# EasyEDA schematic BroadNodeVerticle.json
TITLE: BroadNodeBase; REV: 1.0; Date: 2020-12-08; Sheet: 1/1; Drawn By: 36062A; Company: theBroadCorp.
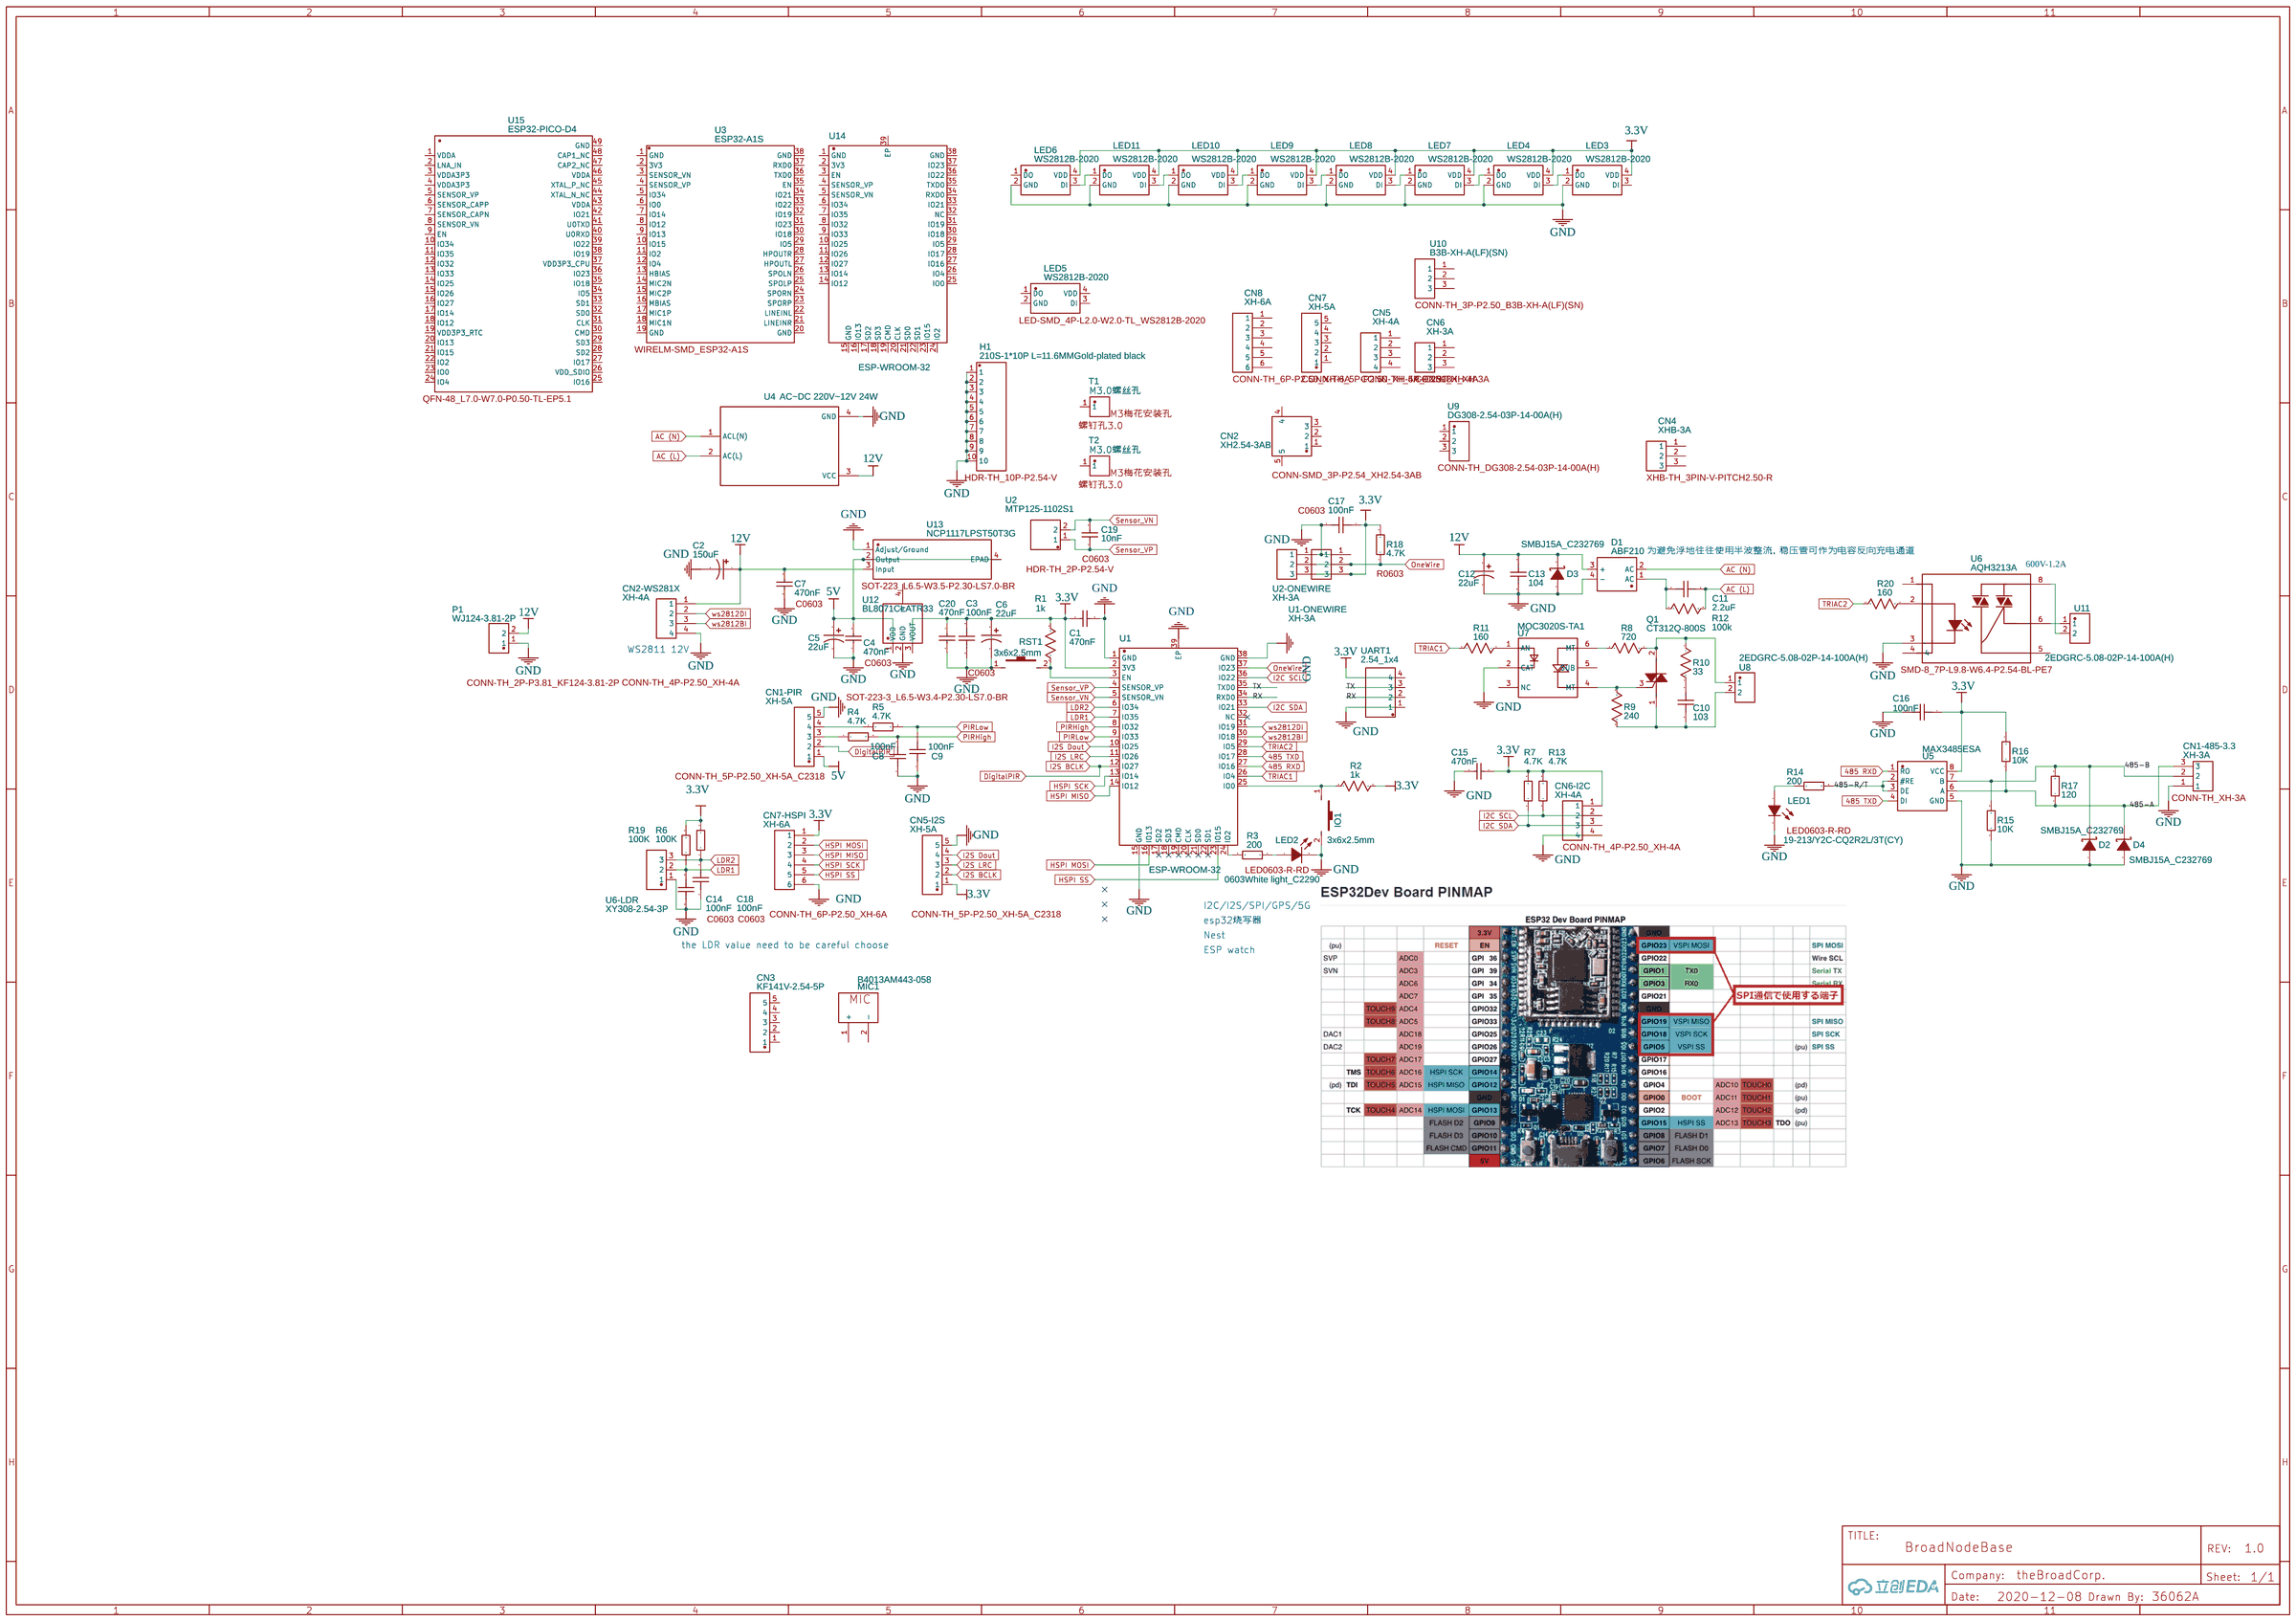
[diagram p0: schematic sheet]

## Parts
C1  470nF  [C0603]
C2  150uF  [CAP-SMD_BD8.0-L8.3-W8.3-RD]
C3  100nF  [C0603]
C4  470nF  [C0603]
C5  22uF  [CAP-SMD_BD6.3-L6.6-W6.6-FD]
C6  22uF  [CAP-SMD_BD6.3-L6.6-W6.6-FD]
C7  470nF  [C0603]
C8  100nF  [C0603]
C9  100nF  [C0603]
C10  103  [0603]
C11  2.2uF  [0603]
C12  22uF  [CAP-SMD_BD6.3-L6.6-W6.6-FD]
C13  104  [0603]
C14  100nF  [C0603]
C15  470nF  [C0603]
C16  100nF  [CAP_0603]
C17  100nF  [C0603]
C18  100nF  [C0603]
C19  10nF  [C0603]
C20  470nF  [C0603]
CN1-485-3  XH-3A  [CONN-TH_XH-3A]  (section 3)
CN1-PIR  XH-5A  [CONN-TH_5P-P2.50_XH-5A_C2318]
CN2  XH2.54-3AB  [CONN-SMD_3P-P2.54_XH2.54-3AB]
CN2-WS281X  XH-4A  [CONN-TH_4P-P2.50_XH-4A]
CN3  KF141V-2.54-5P  [CONN-TH_5P-P2.54_KF141V-2.54-5P]
CN4  XHB-3A  [XHB-TH_3PIN-V-PITCH2.50-R]
CN5  XH-4A  [CONN-TH_4P-P2.50_XH-4A]
CN5-I2S  XH-5A  [CONN-TH_5P-P2.50_XH-5A_C2318]
CN6  XH-3A  [CONN-TH_XH-3A]
CN6-I2C  XH-4A  [CONN-TH_4P-P2.50_XH-4A]
CN7  XH-5A  [CONN-TH_5P-P2.50_XH-5A_C2318]
CN7-HSPI  XH-6A  [CONN-TH_6P-P2.50_XH-6A]
CN8  XH-6A  [CONN-TH_6P-P2.50_XH-6A]
D1  ABF210  [ABS_L5.3-W4.6-P4.00-LS6.8-BL]
D2  SMBJ15A_C232769  [SMB(DO-214AA)]
D3  SMBJ15A_C232769  [SMB(DO-214AA)]
D4  SMBJ15A_C232769  [SMB(DO-214AA)]
H1  210S-1*10P L=11.6MMGold-plated black  [HDR-TH_10P-P2.54-V]
IO1  3x6x2.5mm  [KEY-3.0*6.0]
LED1  19-213/Y2C-CQ2R2L/3T(CY)  [LED0603-R-RD]
LED2  0603White light_C2290  [LED0603-R-RD]
LED3  WS2812B-2020  [LED-SMD_4P-L2.0-W2.0-TL_WS2812B-2020]
LED4  WS2812B-2020  [LED-SMD_4P-L2.0-W2.0-TL_WS2812B-2020]
LED5  WS2812B-2020  [LED-SMD_4P-L2.0-W2.0-TL_WS2812B-2020]
LED6  WS2812B-2020  [LED-SMD_4P-L2.0-W2.0-TL_WS2812B-2020]
LED7  WS2812B-2020  [LED-SMD_4P-L2.0-W2.0-TL_WS2812B-2020]
LED8  WS2812B-2020  [LED-SMD_4P-L2.0-W2.0-TL_WS2812B-2020]
LED9  WS2812B-2020  [LED-SMD_4P-L2.0-W2.0-TL_WS2812B-2020]
LED10  WS2812B-2020  [LED-SMD_4P-L2.0-W2.0-TL_WS2812B-2020]
LED11  WS2812B-2020  [LED-SMD_4P-L2.0-W2.0-TL_WS2812B-2020]
MIC1  B4013AM443-058  [MIC-SMD_BD4.0_B4013AM423-093]
P1  WJ124-3.81-2P  [CONN-TH_2P-P3.81_KF124-3.81-2P]
Q1  CT312Q-800S  [TO-263-2_L10.1-W9.1-P5.08-LS15.2-BR]
R1  1k  [0603]
R2  1k  [0603]
R3  200  [RES_0603]
R4  4.7K  [R0603]
R5  4.7K  [R0603]
R6  100K  [R0603]
R7  4.7K  [R0603]
R8  720  [0603]
R9  240  [0603]
R10  33  [0603]
R11  160  [0603]
R12  100k  [0603]
R13  4.7K  [R0603]
R14  200  [RES_0603]
R15  10K  [RES_0603]
R16  10K  [RES_0603]
R17  120  [RES_0603]
R18  4.7K  [R0603]
R19  100K  [R0603]
R20  160  [0603]
RST1  3x6x2.5mm  [KEY-3.0*6.0]
T1  M3.0螺丝孔  [螺钉孔3.0]
T2  M3.0螺丝孔  [螺钉孔3.0]
U1  ESP-WROOM-32  [ESP-WROOM-32]
U1-ONEWIRE  XH-3A  [CONN-TH_XH-3A]
U2  MTP125-1102S1  [HDR-TH_2P-P2.54-V]
U2-ONEWIRE  XH-3A  [CONN-TH_XH-3A]
U3  ESP32-A1S  [WIRELM-SMD_ESP32-A1S]
U4  AC~DC 220V~12V 24W  [AC&#126;DC 220V&#126;12V 24W TB563350789812]
U5  MAX3485ESA  [SOP-8_L5.0-W4.0-P1.27-LS6.0-BL]
U6  AQH3213A  [SMD-8_7P-L9.8-W6.4-P2.54-BL-PE7]
U6-LDR  XY308-2.54-3P  [CONN-TH_XY308-2.54-3P]
U7  MOC3020S-TA1  [SMD-6_L7.3-W6.5-P2.54-LS10.16-BL]
U8  2EDGRC-5.08-02P-14-100A(H)  [CONN-TH_2EDGRC-5.08-02P-14-100A(H)]
U9  DG308-2.54-03P-14-00A(H)  [CONN-TH_DG308-2.54-03P-14-00A(H)]
U10  B3B-XH-A(LF)(SN)  [CONN-TH_3P-P2.50_B3B-XH-A(LF)(SN)]
U11  2EDGRC-5.08-02P-14-100A(H)  [CONN-TH_2EDGRC-5.08-02P-14-100A(H)]
U12  BL8071CLATR33  [SOT-223-3_L6.5-W3.4-P2.30-LS7.0-BR]
U13  NCP1117LPST50T3G  [SOT-223_L6.5-W3.5-P2.30-LS7.0-BR]
U14  ESP-WROOM-32  [ESP-WROOM-32]
U15  ESP32-PICO-D4  [QFN-48_L7.0-W7.0-P0.50-TL-EP5.1]
UART1  2.54_1x4  [DIP-1X4P-2.54MM-M]

## Library data of the parts
C1 C15 C20 = CL10B474KA8NNNC: Supplier: LCSC; Manufacturer: SAMSUNG; Supplier Part: C1623; SMT Type: Basic; JLCPCB SMD: Yes; Package Display: No
C2 = OVZ151M1C0807-TRO: Supplier: LCSC; Supplier Part: C250092; Manufacturer: Lelon; Contributor: LCSC; SMT Type: Extend; JLCPCB SMD: Yes
C3 C14 C17 C18 = CC0603KRX7R9BB104: Supplier: LCSC; Manufacturer: YAGEO; Supplier Part: C14663; SMT Type: Basic; JLCPCB SMD: Yes; Package Display: Yes
C4 C7 = CL10B474KA8NNNC: Supplier: LCSC; Manufacturer: SAMSUNG; Supplier Part: C1623; SMT Type: Basic; JLCPCB SMD: Yes; Package Display: Yes
C5 C6 C12 = OCV220M1VTR-0606: Supplier: LCSC; Supplier Part: C473426; Manufacturer: Lelon; Contributor: LCSC
C8 C9 = CC0603KRX7R9BB104: Supplier: LCSC; Manufacturer: YAGEO; Supplier Part: C14663; SMT Type: Basic; JLCPCB SMD: Yes; Package Display: No
C10 = Cap_0603_US: Manufacturer Part: 0603B103K500NT; Supplier: LCSC; Manufacturer: FH; Supplier Part: C57112
C11 = Cap_0603_US
C13 = Cap_0603_US: Manufacturer Part: CL10B224KA8NNNC; Supplier: LCSC; Manufacturer: SAMSUNG; Supplier Part: C21120
C16 = CC0603KRX7R9BB104: Supplier: LCSC; Manufacturer: YAGEO; LCSC Assembly: Yes; Supplier Part: C14663; SMT Type: Basic
C19 = 0603B103K500NT: Supplier: LCSC; Manufacturer: FH; Supplier Part: C57112; SMT Type: Basic; JLCPCB SMD: Yes; Package Display: Yes
CN1-485-3 CN6 = XH-3A: Supplier: LCSC; Manufacturer: BOOMELE; image: //image.lceda.cn/szlcsc/C2316.jpg; Supplier Part: C2316; Package Display: Yes
CN1-PIR CN5-I2S CN7 = XH-5A: Supplier: LCSC; Manufacturer: BOOMELE; image: //image.lceda.cn/szlcsc/C2318.jpg; Supplier Part: C2318; Package Display: Yes
CN2 = XH2.54-3AB: Supplier: LCSC; Supplier Part: C146126; Manufacturer: Boom Precision Elec; Contributor: LCSC; Package Display: Yes
CN2-WS281X CN5 CN6-I2C = XH-4A: Supplier: LCSC; Manufacturer: BOOMELE; image: //image.lceda.cn/szlcsc/C37815.jpg; Supplier Part: C37815; Package Display: Yes
CN3 = KF141V-2.54-5P: Supplier: LCSC; Supplier Part: C475117; Manufacturer: Cixi Kefa Elec; Contributor: LCSC
CN4 = XHB-3A: Supplier: LCSC; Manufacturer: BOOMELE; image: //image.lceda.cn/szlcsc/C68817.jpg; Supplier Part: C68817; Package Display: Yes
CN7-HSPI CN8 = XH-6A: Supplier: LCSC; Manufacturer: BOOMELE; image: //image.lceda.cn/szlcsc/C5663.jpg; Supplier Part: C5663; Package Display: Yes
D1 = ABF210: Supplier: LCSC; Manufacturer: Jingdao; Contributor: LCSC; Supplier Part: C169534; SMT Type: Extend; JLCPCB SMD: Yes
D2-D4 = -: Supplier: LCSC; Supplier Part: C232769; Manufacturer: ON Semicon; Manufacturer Part: SMBJ15A; Contributor: LCSC
H1 = 210S-1*10P L=11.6MMGold-plated black: Supplier: LCSC; Manufacturer: Ckmtw; Contributor: LCSC; Supplier Part: C124372; Package Display: Yes
IO1 RST1 = -: Supplier Part: C5382; Supplier: LCSC; Manufacturer: ReliaPro
LED1 = 19-213/Y2C-CQ2R2L/3T(CY): Supplier: LCSC; Manufacturer: EVERLIGHT; image: //image.lceda.cn/szlcsc/C72038.jpg; Supplier Part: C72038; SMT Type: Basic; JLCPCB SMD: Yes; Package Display: Yes
LED2 = 0603White light_C2290: Supplier: LCSC; Manufacturer: KENTO; Manufacturer Part: 0603White light; image: //image.lceda.cn/szlcsc/C2290.jpg; Supplier Part: C2290; SMT Type: Basic; JLCPCB SMD: Yes; Package Display: Yes
LED3 LED4 LED6-LED11 = WS2812B-2020: Supplier: LCSC; Supplier Part: C965555; Manufacturer: Worldsemi; Contributor: LCSC; Package Display: No
LED5 = WS2812B-2020: Supplier: LCSC; Supplier Part: C965555; Manufacturer: Worldsemi; Contributor: LCSC; Package Display: Yes
MIC1 = B4013AM443-058: Supplier: LCSC; Supplier Part: C233795; Manufacturer: Goertek; Contributor: LCSC
P1 = WJ124-3.81-2P: Supplier: LCSC; Manufacturer: ReliaPro; image: //image.lceda.cn/szlcsc/C69811.jpg; Supplier Part: C69811; Package Display: Yes
Q1 = CT312Q-800S: Supplier: LCSC; Supplier Part: C527795; Manufacturer: CJ; Contributor: LCSC; SMT Type: Extend; JLCPCB SMD: Yes
R1 R2 R8 = Res_0603(1/10W)_US: Manufacturer Part: 0603WAF7500T5E; Supplier: LCSC; Manufacturer: UniOhm; Supplier Part: C23241
R3 R14 = MCR03EZPJ201: Supplier: LCSC; Supplier Part: C253407; Manufacturer: ROHM Semicon; Contributor: LCSC
R4 R5 R7 R13 = 0603WAF4701T5E: Supplier: LCSC; Manufacturer: UniOhm; Supplier Part: C23162; SMT Type: Basic; JLCPCB SMD: Yes
R6 R19 = 0603WAF1003T5E: Supplier: LCSC; Manufacturer: UniOhm; Supplier Part: C25803; SMT Type: Basic; JLCPCB SMD: Yes
R9 = Res_0603(1/10W)_US: Manufacturer Part: 0603WAF2200T5E; Supplier: LCSC; Manufacturer: UniOhm; Supplier Part: C22962
R10 = Res_0603(1/10W)_US: Manufacturer Part: 0603WAF330JT5E; Supplier: LCSC; Manufacturer: UniOhm; Supplier Part: C23140
R11 R20 = Res_0603(1/10W)_US: Manufacturer Part: 0603WAF1600T5E; Supplier: LCSC; Manufacturer: UniOhm; Supplier Part: C22814
R12 = Res_0603(1/10W)_US: Manufacturer Part: 0603WAF2003T5E; Supplier: LCSC; Manufacturer: UniOhm; Supplier Part: C25811
R15 R16 = RMCF0603JT10K0: Supplier: LCSC; Supplier Part: C238881; Manufacturer: Stackpole Elec; Contributor: LCSC
R17 = MCR03EZPFX1200: Supplier: LCSC; Supplier Part: C253379; Manufacturer: ROHM Semicon; Contributor: LCSC
R18 = 0603WAF4701T5E: Supplier: LCSC; Manufacturer: UniOhm; Supplier Part: C23162; SMT Type: Basic; JLCPCB SMD: Yes; Package Display: Yes
T1 T2 = M3.0螺丝孔: Contributor: wowlkh; Package Display: Yes
U1 U14 = -: Supplier: LCSC; Manufacturer: ESPRESSIF; Supplier Part: C95209
U1-ONEWIRE U2-ONEWIRE = XH-3A: Supplier: LCSC; Manufacturer: BOOMELE; image: //image.lceda.cn/szlcsc/C2316.jpg; Supplier Part: C2316; Package Display: No
U2 = MTP125-1102S1: Supplier: LCSC; Supplier Part: C358684; Manufacturer: MINTRON; Contributor: LCSC; Package Display: Yes
U3 = ESP32-A1S: Supplier: LCSC; Supplier Part: C277945; Manufacturer: Ai-Thinker; Contributor: LCSC; Package Display: Yes
U4 = AC&#126;DC 220V&#126;12V 24W: Manufacturer Part: New SchematicLib; Contributor: Kisro
U5 = MAX3485ESA: Supplier: LCSC; Supplier Part: C668204; Manufacturer: UMW(Youtai Semiconductor Co., Ltd.); Contributor: LCSC
U6 = AQH3213A: Supplier: LCSC; Manufacturer: PANASONIC; Contributor: LCSC; Supplier Part: C91557; Package Display: Yes
U6-LDR = XY308-2.54-3P: Supplier: LCSC; Supplier Part: C557686; Manufacturer: --; Contributor: LCSC
U7 = MOC3020S-TA1: Supplier: LCSC; Manufacturer: LITEON; Contributor: LCSC; Supplier Part: C115464; SMT Type: Extend; JLCPCB SMD: Yes
U8 U11 = 2EDGRC-5.08-02P-14-100A(H): Supplier: LCSC; Supplier Part: C669314; Manufacturer: DEGSON; Contributor: LCSC
U9 = DG308-2.54-03P-14-00A(H): Supplier: LCSC; Supplier Part: C691850; Manufacturer: DEGSON; Contributor: LCSC; Package Display: Yes
U10 = B3B-XH-A(LF)(SN): Supplier: LCSC; Supplier Part: C144394; Manufacturer: JST Sales America; Contributor: LCSC; Package Display: Yes
U12 = BL8071CLATR33: Supplier: LCSC; Supplier Part: C401677; Manufacturer: Shanghai Belling; Contributor: LCSC; Package Display: Yes
U13 = NCP1117LPST50T3G: Supplier: LCSC; Supplier Part: C185806; Manufacturer: ON Semicon; Contributor: LCSC; SMT Type: Extend; JLCPCB SMD: Yes; Package Display: Yes
U15 = ESP32-PICO-D4: Supplier: LCSC; Supplier Part: C193707; Manufacturer: Espressif Systems; Contributor: LCSC; SMT Type: Extend; JLCPCB SMD: Yes; Package Display: Yes
UART1 = -: Supplier: LCSC; Manufacturer: Ckmtw; Manufacturer Part: 210S-1*4P L=11.6MMGold-plated black; Contributor: LCSC; Supplier Part: C124378

## Nets
3.3V: C1.2 C3.2 C6.1 C15.1 C16.1 C17.1 C20.1 CN5-I2S.1 CN6-I2C.1 CN7-HSPI.1 LED3.4(VDD) LED4.4(VDD) LED6.4(VDD) LED7.4(VDD) LED8.4(VDD) LED9.4(VDD) LED10.4(VDD) LED11.4(VDD) R1.2 R2.2 R6.2 R7.2 R13.2 R16.2 R18.2 R19.2 U1.2(3V3) U1-ONEWIRE.3 U2-ONEWIRE.3 U5.8(VCC) U12.3(VOUT) UART1.4
5V: C4.2 C5.1 CN1-PIR.1 U12.1(VDD) U13.2(Output) U13.4(EPAD)
12V: C2.1 C7.2 C12.1 C13.1 CN2-WS281X.1 D1.3(+) D3.2(K) P1.2 U4.3(VCC) U13.3(Input)
GND: C1.1 C2.2 C3.1 C4.1 C5.2 C6.2 C7.1 C8.1 C9.1 C12.2 C13.2 C14.1 C15.2 C16.2 C17.2 C18.1 C20.2 CN1-485-3.1 CN1-PIR.5 CN2-WS281X.4 CN5-I2S.5 CN6-I2C.4 CN7-HSPI.6 D1.4(-) D2.1(A) D3.1(A) D4.1(A) H1.1 H1.2 H1.3 H1.4 H1.5 H1.6 H1.7 H1.8 H1.9 H1.10 IO1.2 LED1.2(C) LED2.2(K) LED3.2(GND) LED4.2(GND) LED6.2(GND) LED7.2(GND) LED8.2(GND) LED9.2(GND) LED10.2(GND) LED11.2(GND) P1.1 R15.1 RST1.1 U1.1(GND) U1.15(GND) U1.38(GND) U1.39(EP) U1-ONEWIRE.1 U2-ONEWIRE.1 U4.4(GND) U5.5(GND) U6.3 U6-LDR.1 U7.2(CAT) U12.2(GND) U13.1(Adjust/Ground) UART1.1
485 RXD: U1.27(IO16) U5.1(RO)
485 TXD: U1.28(IO17) U5.4(DI)
485-A: CN1-485-3.3 D4.2(K) R16.1 R17.1 U5.6(A)
485-B: CN1-485-3.2 D2.2(K) R15.2 R17.2 U5.7(B)
485-R/T: R14.2 U5.2(#RE) U5.3(DE)
AC (L): C11.2 R12.2 U4.2(AC(L))
AC (N): D1.2(AC) U4.1(ACL(N))
DigitalPIR: CN1-PIR.2 CN5-I2S.2 U1.12(IO27)
HSPI MISO: CN7-HSPI.3 U1.14(IO12)
HSPI MOSI: CN7-HSPI.2 U1.16(IO13)
HSPI SCK: CN7-HSPI.4 U1.13(IO14)
HSPI SS: CN7-HSPI.5 U1.23(IO15)
I2C SCL: CN6-I2C.2 R13.1 U1.36(IO22)
I2C SDA: CN6-I2C.3 R7.1 U1.33(IO21)
I2S Dout: CN5-I2S.4 U1.10(IO25)
I2S LRC: CN5-I2S.3 U1.11(IO26)
LDR1: C14.2 R19.1 U1.7(IO35) U6-LDR.2
LDR2: C18.2 R6.1 U1.6(IO34) U6-LDR.3
OneWire: R18.1 U1.37(IO23) U1-ONEWIRE.2 U2-ONEWIRE.2
PIRHigh: C8.2 R4.2 U1.8(IO32)
PIRLow: C9.2 R5.2 U1.9(IO33)
RX: U1.34(RXD0) UART1.2
Sensor_VN: C19.2 U1.5(SENSOR_VN) U2.2
Sensor_VP: C19.1 U1.4(SENSOR_VP) U2.1
TRIAC1: R11.2 U1.26(IO4)
TRIAC2: R20.2 U1.29(IO5)
TX: U1.35(TXD0) UART1.3
ws2812BI: CN2-WS281X.3 U1.30(IO18)
ws2812DI: CN2-WS281X.2 U1.31(IO19)
Net-(C10-1): C10.1 R10.2
Net-(C10-2): C10.2 Q1.1(T1) R9.1 U8.2
Net-(C11-1): C11.1 D1.1(AC) R12.1
Net-(CN1-PIR-3): CN1-PIR.3 R4.1
Net-(CN1-PIR-4): CN1-PIR.4 R5.1
Net-(IO1-1): IO1.1 R2.1 U1.25(IO0)
Net-(LED1-1): LED1.1(A) R14.1
Net-(LED2-1): LED2.1(A) R3.1
Net-(LED3-1): LED3.1(DO) LED4.3(DI)
Net-(LED4-1): LED4.1(DO) LED7.3(DI)
Net-(LED6-3): LED6.3(DI) LED11.1(DO)
Net-(LED7-1): LED7.1(DO) LED8.3(DI)
Net-(LED8-1): LED8.1(DO) LED9.3(DI)
Net-(LED9-1): LED9.1(DO) LED10.3(DI)
Net-(LED10-1): LED10.1(DO) LED11.3(DI)
Net-(Q1-2): Q1.2(T2) R8.1 R10.1 U8.1
Net-(Q1-3): Q1.3(G) R9.2 U7.4(MT)
Net-(R1-1): R1.1 RST1.2 U1.3(EN)
Net-(R3-2): R3.2 U1.24(IO2)
Net-(R8-2): R8.2 U7.6(MT)
Net-(R11-1): R11.1 U7.1(AN)
Net-(R20-1): R20.1 U6.2
Net-(U6-6): U6.6 U11.1
Net-(U6-8): U6.8 U11.2

Not connected (* = marked no-connect by the designer): CN2 1 2 3 4 5; CN3 1 2 3 4 5; CN4 1 2 3; CN5 1 2 3 4; CN6 1 2 3; CN7 1 2 3 4 5; CN8 1 2 3 4 5 6; LED3 3(DI); LED5 1(DO) 2(GND) 3(DI) 4(VDD); LED6 1(DO); MIC1 1(+) 2(-); T1 1; T2 1; U1 17(SD2)* 18(SD3)* 19(CMD)* 20(CLK)* 21(SD0)* 22(SD1)* 32(NC)*; U3 1(GND) 2(3V3) 3(SENSOR_VN) 4(SENSOR_VP) 5(IO34) 6(IO0) 7(IO14) 8(IO12) 9(IO13) 10(IO15) 11(IO2) 12(IO4) 13(HBIAS) 14(MIC2N) 15(MIC2P) 16(MBIAS) 17(MIC1P) 18(MIC1N) 19(GND) 20(GND) 21(LINEINR) 22(LINEINL) 23(SPORP) 24(SPORN) 25(SPOLP) 26(SPOLN) 27(HPOUTL) 28(HPOUTR) 29(IO5) 30(IO18) 31(IO23) 32(IO19) 33(IO22) 34(IO21) 35(EN) 36(TXD0) 37(RXD0) 38(GND); U6 1 4 5; U7 3(NC) 5(SUB); U9 1 2 3; U10 1 2 3; U12 4; U14 1(GND) 2(3V3) 3(EN) 4(SENSOR_VP) 5(SENSOR_VN) 6(IO34) 7(IO35) 8(IO32) 9(IO33) 10(IO25) 11(IO26) 12(IO27) 13(IO14) 14(IO12) 15(GND) 16(IO13) 17(SD2) 18(SD3) 19(CMD) 20(CLK) 21(SD0) 22(SD1) 23(IO15) 24(IO2) 25(IO0) 26(IO4) 27(IO16) 28(IO17) 29(IO5) 30(IO18) 31(IO19) 32(NC) 33(IO21) 34(RXD0) 35(TXD0) 36(IO22) 37(IO23) 38(GND) 39(EP); U15 1(VDDA) 2(LNA_IN) 3(VDDA3P3) 4(VDDA3P3) 5(SENSOR_VP) 6(SENSOR_CAPP) 7(SENSOR_CAPN) 8(SENSOR_VN) 9(EN) 10(IO34) 11(IO35) 12(IO32) 13(IO33) 14(IO25) 15(IO26) 16(IO27) 17(IO14) 18(IO12) 19(VDD3P3_RTC) 20(IO13) 21(IO15) 22(IO2) 23(IO0) 24(IO4) 25(IO16) 26(VDD_SDIO) 27(IO17) 28(SD2) 29(SD3) 30(CMD) 31(CLK) 32(SD0) 33(SD1) 34(IO5) 35(IO18) 36(IO23) 37(VDD3P3_CPU) 38(IO19) 39(IO22) 40(U0RXD) 41(U0TXD) 42(IO21) 43(VDDA) 44(XTAL_N_NC) 45(XTAL_P_NC) 46(VDDA) 47(CAP2_NC) 48(CAP1_NC) 49(GND)

## Notes on the sheet
- 为避免浮地往往使用半波整流，稳压管可作为电容反向充电通道
- 600V-1.2A
- WS2811 12V
- I2C/I2S/SPI/GPS/5G
- esp32烧写器
- Nest
- the LDR value need to be careful choose
- ESP watch
